# EAGLE design TQFP-40 Breakout (EAGLE 5.11)
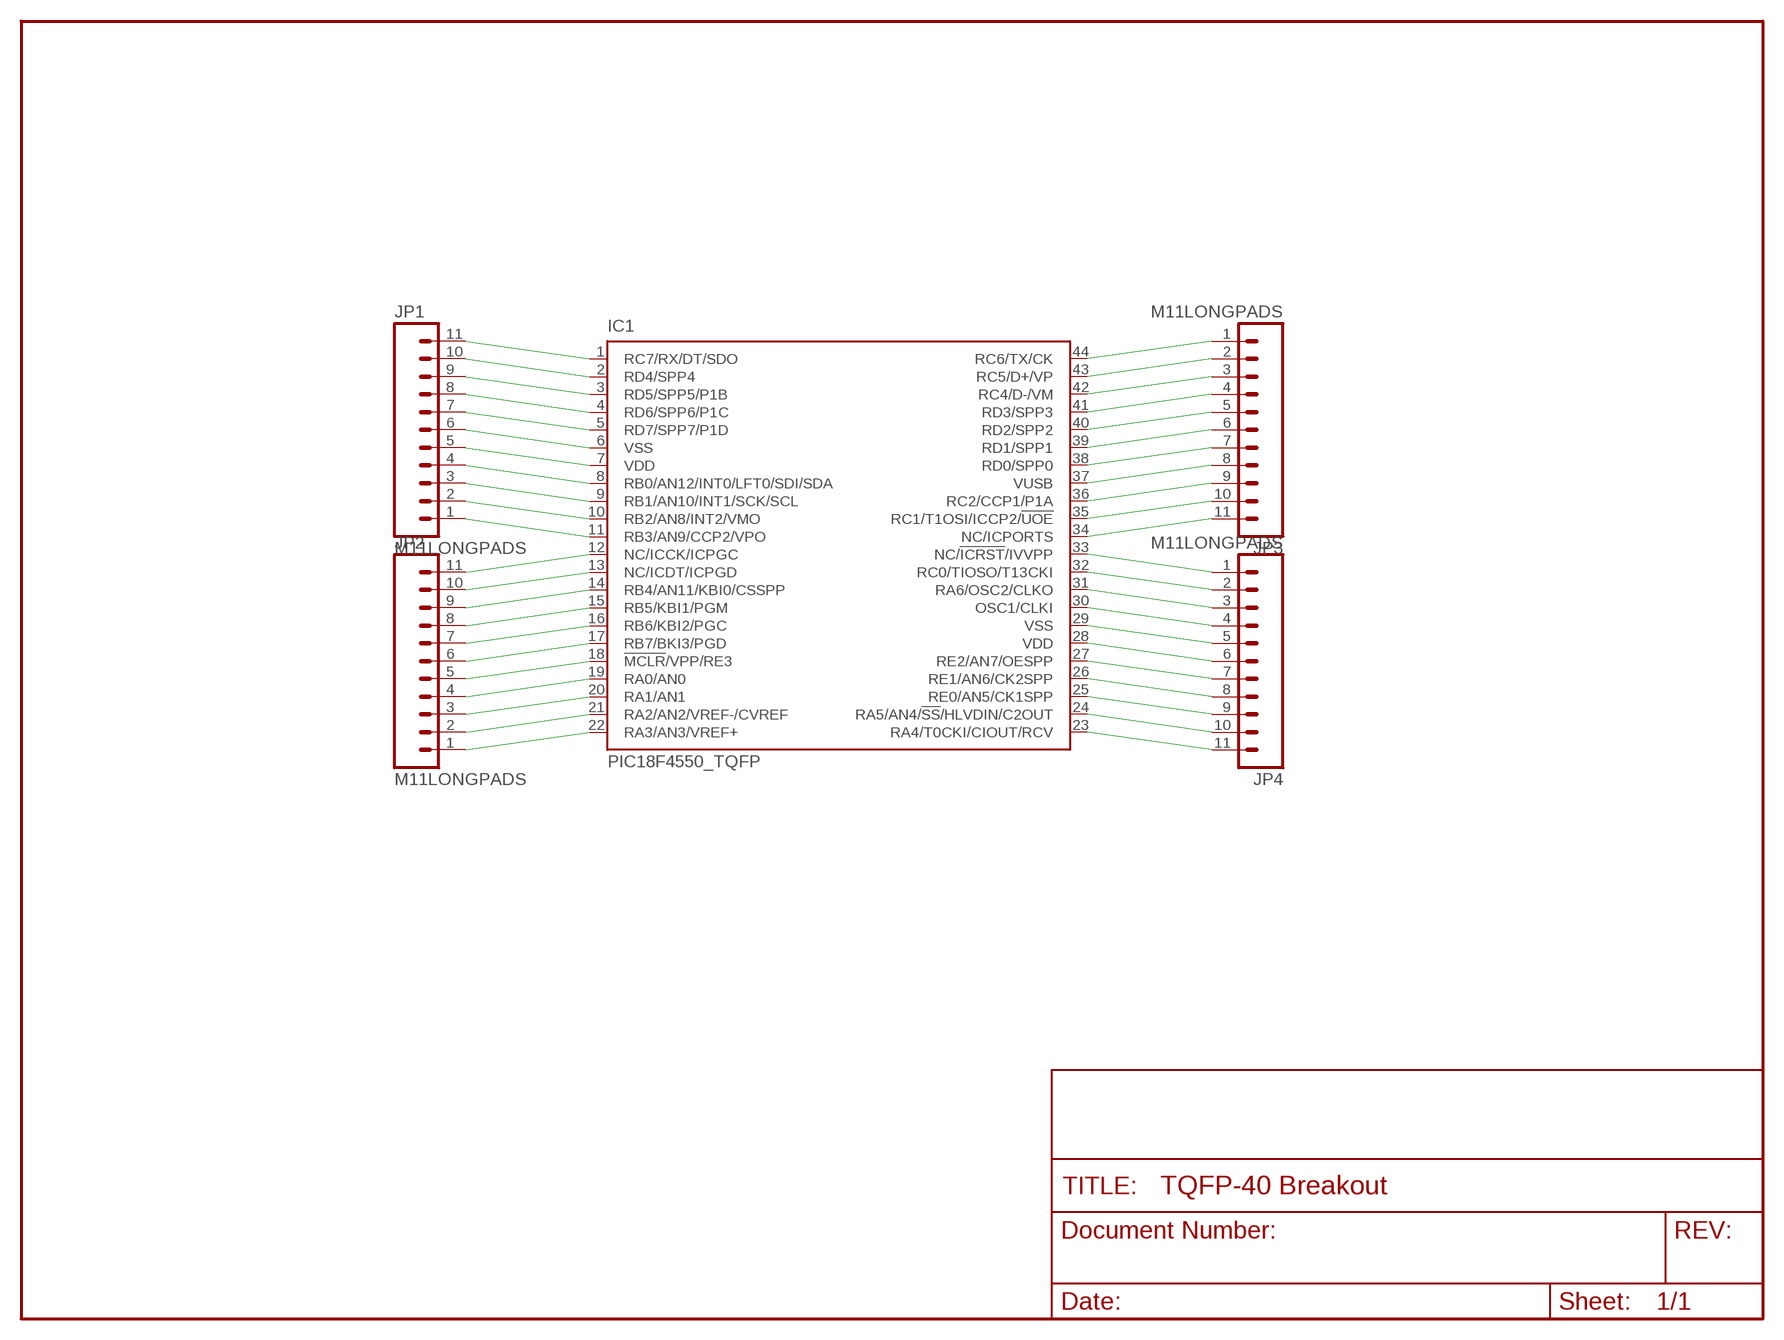
[diagram p0: schematic, sheet 1]

## Parts
IC1  PIC18F4550_TQFP  [TQFP44]
JP1  M11LONGPADS  [1X11_LONGPADS]
JP2  M11LONGPADS  [1X11_LONGPADS]
JP3  M11LONGPADS  [1X11_LONGPADS]
JP4  M11LONGPADS  [1X11_LONGPADS]

## Nets
N$1: IC1.11(RB3/AN9/CCP2/VPO) JP1.1
N$2: IC1.10(RB2/AN8/INT2/VMO) JP1.2
N$3: IC1.9(RB1/AN10/INT1/SCK/SCL) JP1.3
N$4: IC1.8(RB0/AN12/INT0/LFT0/SDI/SDA) JP1.4
N$5: IC1.7(VDD) JP1.5
N$6: IC1.6(VSS) JP1.6
N$7: IC1.5(RD7/SPP7/P1D) JP1.7
N$8: IC1.4(RD6/SPP6/P1C) JP1.8
N$9: IC1.3(RD5/SPP5/P1B) JP1.9
N$10: IC1.2(RD4/SPP4) JP1.10
N$11: IC1.1(RC7/RX/DT/SDO) JP1.11
N$12: IC1.22(RA3/AN3/VREF+) JP2.1
N$13: IC1.21(RA2/AN2/VREF-/CVREF) JP2.2
N$14: IC1.20(RA1/AN1) JP2.3
N$15: IC1.19(RA0/AN0) JP2.4
N$16: IC1.18(!MCLR!/VPP/RE3) JP2.5
N$17: IC1.17(RB7/BKI3/PGD) JP2.6
N$18: IC1.16(RB6/KBI2/PGC) JP2.7
N$19: IC1.15(RB5/KBI1/PGM) JP2.8
N$20: IC1.14(RB4/AN11/KBI0/CSSPP) JP2.9
N$21: IC1.13(NC/ICDT/ICPGD) JP2.10
N$22: IC1.12(NC/ICCK/ICPGC) JP2.11
N$23: IC1.44(RC6/TX/CK) JP3.1
N$24: IC1.43(RC5/D+/VP) JP3.2
N$25: IC1.42(RC4/D-/VM) JP3.3
N$26: IC1.41(RD3/SPP3) JP3.4
N$27: IC1.40(RD2/SPP2) JP3.5
N$28: IC1.39(RD1/SPP1) JP3.6
N$29: IC1.38(RD0/SPP0) JP3.7
N$30: IC1.37(VUSB) JP3.8
N$31: IC1.36(RC2/CCP1/P1A) JP3.9
N$32: IC1.35(RC1/T1OSI/ICCP2/!UOE) JP3.10
N$33: IC1.34(NC/ICPORTS) JP3.11
N$34: IC1.33(NC/!ICRST!/IVVPP) JP4.1
N$35: IC1.32(RC0/TIOSO/T13CKI) JP4.2
N$36: IC1.31(RA6/OSC2/CLKO) JP4.3
N$37: IC1.30(OSC1/CLKI) JP4.4
N$38: IC1.29(VSS) JP4.5
N$39: IC1.28(VDD) JP4.6
N$40: IC1.27(RE2/AN7/OESPP) JP4.7
N$41: IC1.26(RE1/AN6/CK2SPP) JP4.8
N$42: IC1.25(RE0/AN5/CK1SPP) JP4.9
N$43: IC1.24(RA5/AN4/!SS!/HLVDIN/C2OUT) JP4.10
N$44: IC1.23(RA4/T0CKI/CIOUT/RCV) JP4.11

## Library data of the parts
IC1 = microchip:PIC18F4*_TQFP: USB Microcontrollers with nanoWatt Technology High-Performance, Enhanced Flash, 28/40/44-Pin, Source: http://ww1.microchip.com/downloads/en/devicedoc/39632c.pdf; MF: MICROCHIP; MPN: PIC18F4550-I/PT; OC_FARNELL: 9321365; OC_NEWARK: 08J9633
JP1-JP4 = SparkFun:M11: Header 11 Standard 11-pin 0.1" header. Use with straight break away headers (SKU : PRT-00116), right angle break away headers (PRT-00553), swiss pins (PRT-00743), machine pins (PRT-00117), and female headers (PRT-00115).

## Board
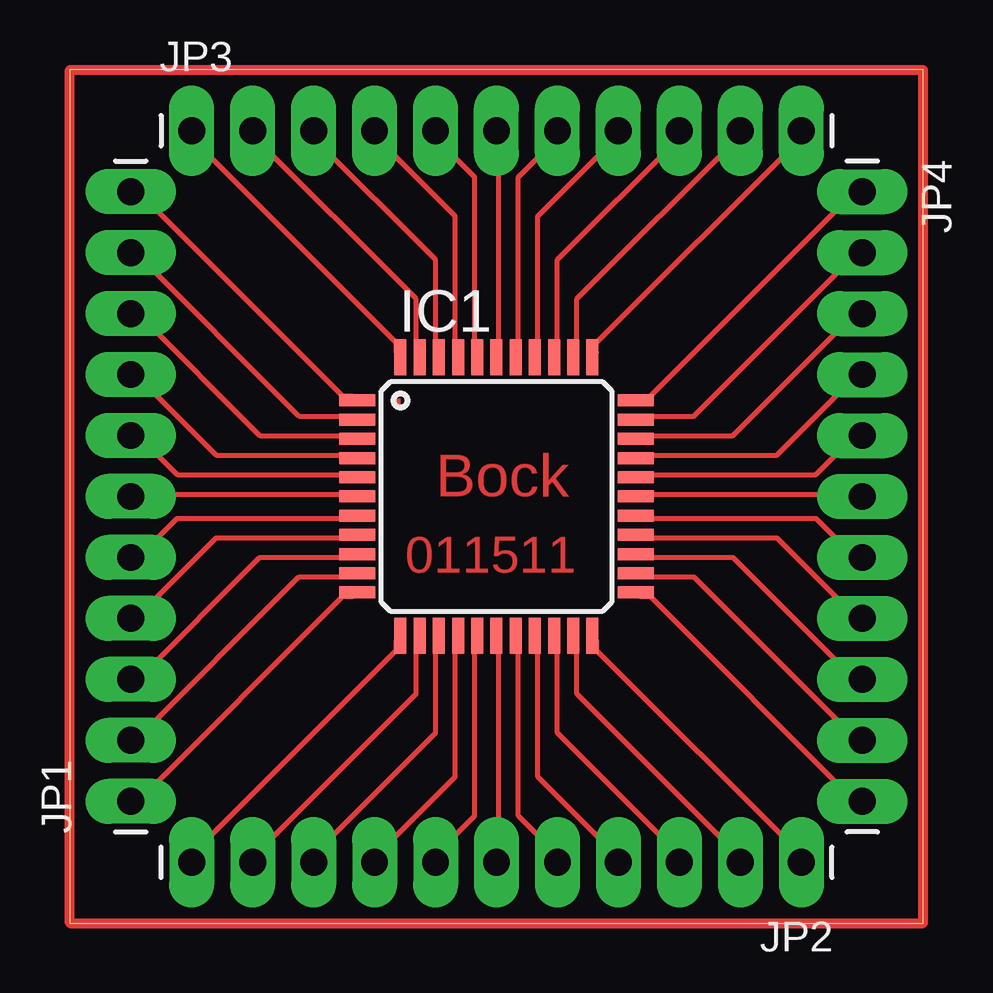
[diagram p1: board, top side]

Size 35.56 x 35.56 mm. Coordinates in mm from the lower left corner, seen from the top.
Outline: 0,0 35.56,0 35.56,35.56 0,35.56 0,0
Copper layers (1*16): Top 0.035mm / dielectric 1.5mm / Bottom 0.035mm
Design rules "SparkFun": minimum track width 8mil, minimum drill 20mil, track to track 8mil, track to pad 8mil, pad to pad 8mil, via to via 8mil, smd to smd 8mil, copper to edge 10mil, drill to drill 8mil, minimum pad ring 12mil, minimum via ring 10mil, stop-mask expansion 4mil, vias tented up to drill 25mil, thermal gap 10mil

### Footprints (pad centres in the part's own frame; a part is rotated, then mirrored left to right if it is on the bottom)
TQFP44 = smd 1.5 x 0.5: 1 -5.8,4; 2 -5.8,3.2; 3 -5.8,2.4; 4 -5.8,1.6; 5 -5.8,0.8; 6 -5.8,0; 7 -5.8,-0.8; 8 -5.8,-1.6; 9 -5.8,-2.4; 10 -5.8,-3.2; 11 -5.8,-4; 23 5.8,-4; 24 5.8,-3.2; 25 5.8,-2.4; 26 5.8,-1.6; 27 5.8,-0.8; 28 5.8,0; 29 5.8,0.8; 30 5.8,1.6; 31 5.8,2.4; 32 5.8,3.2; 33 5.8,4 | smd 0.5 x 1.5: 12 -4,-5.8; 13 -3.2,-5.8; 14 -2.4,-5.8; 15 -1.6,-5.8; 16 -0.8,-5.8; 17 0,-5.8; 18 0.8,-5.8; 19 1.6,-5.8; 20 2.4,-5.8; 21 3.2,-5.8; 22 4,-5.8; 34 4,5.8; 35 3.2,5.8; 36 2.4,5.8; 37 1.6,5.8; 38 0.8,5.8; 39 0,5.8; 40 -0.8,5.8; 41 -1.6,5.8; 42 -2.4,5.8; 43 -3.2,5.8; 44 -4,5.8
1X11_LONGPADS = drill 1.118 pad 1.88 long: 1 0,0; 2 2.54,0; 3 5.08,0; 4 7.62,0; 5 10.16,0; 6 12.7,0; 7 15.24,0; 8 17.78,0; 9 20.32,0; 10 22.86,0; 11 25.4,0

### Placement (x,y rotation side)
IC1  17.78,17.78 0 top
JP1  2.54,5.08 90 top
JP2  30.48,2.54 180 top
JP3  5.08,33.02 0 top
JP4  33.02,30.48 270 top

### Tracks (layer width: path | path; a pad name or v marks a point on that pad's centre or on a via)
N$1
  Top 0.203: IC1.11 11.79,13.61 11.38,13.61 2.85,5.08 JP1.1
N$2
  Top 0.203: IC1.10 11.79,14.43 9.55,14.43 2.64,7.52 JP1.2
N$3
  Top 0.203: IC1.9 11.79,15.24 7.92,15.24 2.85,10.16 JP1.3
N$4
  Top 0.203: IC1.8 11.79,16.05 6.1,16.05 2.64,12.6 JP1.4
N$5
  Top 0.203: IC1.7 11.79,16.87 4.47,16.87 2.85,15.24 JP1.5
N$6
  Top 0.203: IC1.6 11.79,17.88 2.64,17.88 JP1.6
N$7
  Top 0.203: IC1.5 11.79,18.69 4.47,18.69 2.85,20.32 JP1.7
N$8
  Top 0.203: IC1.4 11.79,19.51 6.1,19.51 2.64,22.96 JP1.8
N$9
  Top 0.203: IC1.3 11.79,20.32 7.92,20.32 2.85,25.4 JP1.9
N$10
  Top 0.203: IC1.2 11.79,21.13 9.55,21.13 2.64,28.04 JP1.10
N$11
  Top 0.203: IC1.1 11.79,21.95 11.38,21.95 2.85,30.48 JP1.11
N$12
  Top 0.203: IC1.22 21.95,11.79 21.95,11.38 30.48,2.85 JP2.1
N$13
  Top 0.203: IC1.21 21.13,11.79 21.13,9.55 28.04,2.64 JP2.2
N$14
  Top 0.203: IC1.20 20.32,11.79 20.32,7.92 25.4,2.85 JP2.3
N$15
  Top 0.203: IC1.19 19.51,11.79 19.51,6.1 22.96,2.64 JP2.4
N$16
  Top 0.203: IC1.18 18.69,11.79 18.69,4.47 20.32,2.85 JP2.5
N$17
  Top 0.203: IC1.17 17.88,11.79 17.88,2.64 JP2.6
N$18
  Top 0.203: IC1.16 16.87,11.79 16.87,4.47 15.24,2.85 JP2.7
N$19
  Top 0.203: IC1.15 16.05,11.79 16.05,6.1 12.6,2.64 JP2.8
N$20
  Top 0.203: IC1.14 15.24,11.79 15.24,7.92 10.16,2.85 JP2.9
N$21
  Top 0.203: IC1.13 14.43,11.79 14.43,9.55 7.52,2.64 JP2.10
N$22
  Top 0.203: IC1.12 13.61,11.79 13.61,11.38 5.08,2.85 JP2.11
N$23
  Top 0.203: IC1.44 13.61,23.77 13.61,24.18 5.08,32.72 JP3.1
N$24
  Top 0.203: IC1.43 14.43,23.77 14.43,26.01 7.52,32.92 JP3.2
N$25
  Top 0.203: IC1.42 15.24,23.77 15.24,27.64 10.16,32.72 JP3.3
N$26
  Top 0.203: IC1.41 16.05,23.77 16.05,29.46 12.6,32.92 JP3.4
N$27
  Top 0.203: IC1.40 16.87,23.77 16.87,31.09 15.24,32.72 JP3.5
N$28
  Top 0.203: IC1.39 17.88,23.77 17.88,32.92 JP3.6
N$29
  Top 0.203: IC1.38 18.69,23.77 18.69,31.09 20.32,32.72 JP3.7
N$30
  Top 0.203: IC1.37 19.51,23.77 19.51,29.46 22.96,32.92 JP3.8
N$31
  Top 0.203: IC1.36 20.32,23.77 20.32,27.64 25.4,32.72 JP3.9
N$32
  Top 0.203: IC1.35 21.13,23.77 21.13,26.01 28.04,32.92 JP3.10
N$33
  Top 0.203: IC1.34 21.95,23.77 21.95,24.18 30.48,32.72 JP3.11
N$34
  Top 0.203: IC1.33 23.77,21.95 24.18,21.95 32.72,30.48 JP4.1
N$35
  Top 0.203: IC1.32 23.77,21.13 26.01,21.13 32.92,28.04 JP4.2
N$36
  Top 0.203: IC1.31 23.77,20.32 27.64,20.32 32.72,25.4 JP4.3
N$37
  Top 0.203: IC1.30 23.77,19.51 29.46,19.51 32.92,22.96 JP4.4
N$38
  Top 0.203: IC1.29 23.77,18.69 31.09,18.69 32.72,20.32 JP4.5
N$39
  Top 0.203: IC1.28 23.77,17.88 32.92,17.88 JP4.6
N$40
  Top 0.203: IC1.27 23.77,16.87 31.09,16.87 32.72,15.24 JP4.7
N$41
  Top 0.203: IC1.26 23.77,16.05 29.46,16.05 32.92,12.6 JP4.8
N$42
  Top 0.203: IC1.25 23.77,15.24 27.64,15.24 32.72,10.16 JP4.9
N$43
  Top 0.203: IC1.24 23.77,14.43 26.01,14.43 32.92,7.52 JP4.10
N$44
  Top 0.203: IC1.23 23.77,13.61 24.18,13.61 32.72,5.08 JP4.11
N$45
  Top 0.406: 0,0 0,35.56 35.56,35.56 35.56,0 0,0

### Text on the board
Top: . | Bock | 011511